# EAGLE design AthenaAmpli (EAGLE 7.2.0)
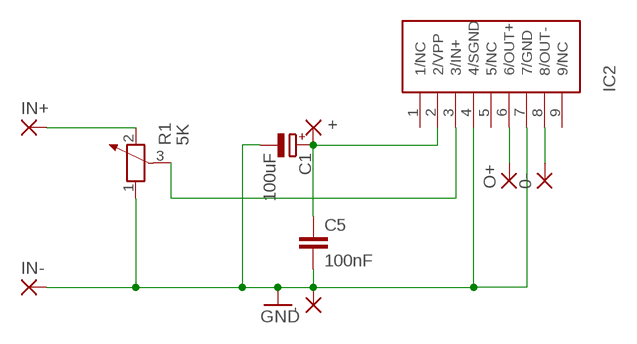
[diagram p0: schematic, sheet 1]

## Parts
0-  WIREPAD3,17/1,2  [3,17/1,2]
+  WIREPAD3,17/1,2  [3,17/1,2]
-  WIREPAD3,17/1,2  [3,17/1,2]
C1  100uF  CPOL-EUE3.5-8  [E3,5-8]
C5  100nF  C-EU050-024X044  [C050-024X044]
IC2  TDA7056  [SOT110-1]
IN+  WIREPAD3,17/1,2  [3,17/1,2]
IN-  WIREPAD3,17/1,2  [3,17/1,2]
O+  WIREPAD3,17/1,2  [3,17/1,2]
R1  5K  POTENTIOMETER_PT-10S  [PT-10S]

## Nets
GND: -.1(P) C1.- C5.2 IC2.4(4/SGND) IC2.7(7/GND) IN-.1(P) R1.1
N$1: +.1(P) C1.+ C5.1 IC2.2(2/VPP)
N$2: IC2.3(3/IN+) R1.3
N$3: IN+.1(P) R1.2
N$6: IC2.6(6/OUT+) O+.1(P)
N$8: 0-.1(P) IC2.8(8/OUT-)
Unconnected: IC2.1(1/NC) IC2.5(5/NC) IC2.9(9/NC)

## Library data of the parts
0- + - IN+ IN- O+ = wirepad:WIREPAD: Wire PAD connect wire on PCB
C1 = rcl:CPOL-EU: POLARIZED CAPACITOR, European symbol
C5 = rcl:C-EU: CAPACITOR, European symbol
IC2 = Audio-Power-amlifier V.2.0:TDA7056: The TDA7056 is a mono output amplifier, designed for battery-fed portable radios and mains-fed equipment such as television. For space reasons there is a trend to decrease the number of external components. For portable applications there is also a trend to decrease the number of battery cells, but still a reasonable output power is required. The TDA7056 fulfills both of these requirements. It needs no peripheral components, because it makes use of the Bridge-Tied-Load (BTL) principle. Consequently it has, at the same supply voltage, a higher output power compared to a conventional Single Ended output stage. It delivers an output power of 1 W into a loudspeaker load of 8 W with 6 V supply or 3 W into 16 W loudspeaker at 11 V without need of an external heatsink. The gain is internally fixed at 40 dB. Special attention is given to switch-on/off click suppression, and it has a good overall stability. The load can be short circuited at all input conditions.
R1 = rcl:POTENTIOMETER_: Potentiometer

## Board
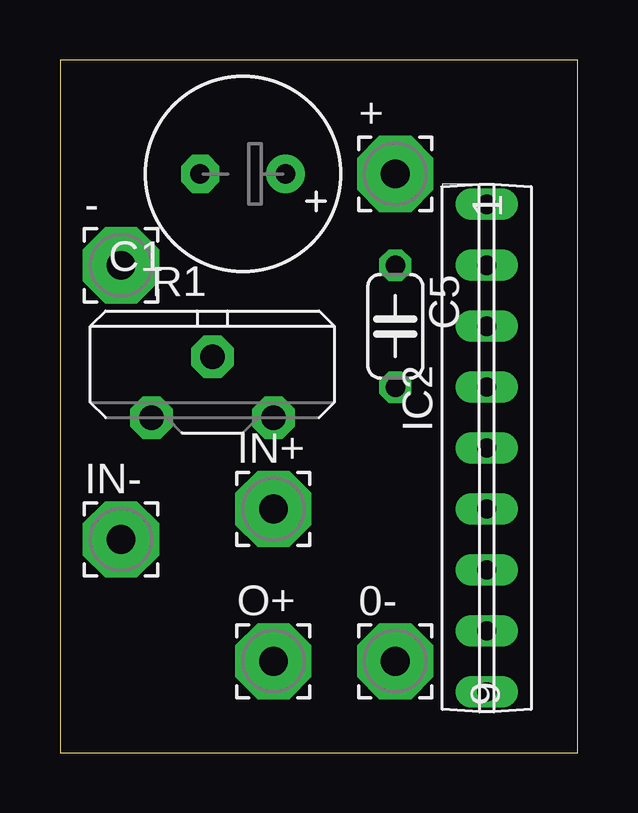
[diagram p1: board, top side]
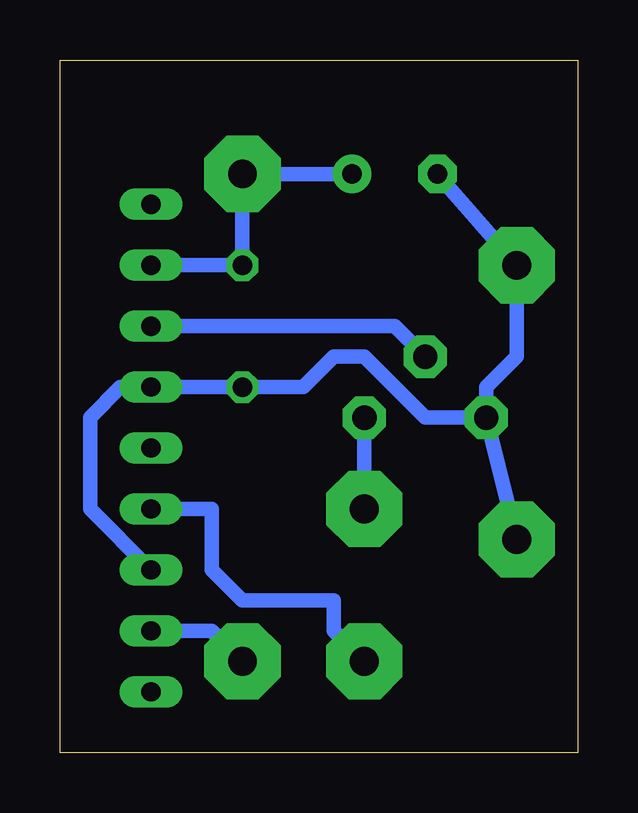
[diagram p2: board, bottom side, seen from below]

Size 21.57 x 28.88 mm. Coordinates in mm from the lower left corner, seen from the top.
Outline: 0,0 21.57,0 21.57,28.88 0,28.88 0,0
Copper layers (1*16): Top 0.035mm / dielectric 1.5mm / Bottom 0.035mm
Design rules "default": minimum track width 10mil, minimum drill 24mil, track to track 8mil, track to pad 8mil, pad to pad 8mil, via to via 8mil, smd to smd 8mil, copper to edge 40mil, drill to drill 8mil, minimum pad ring 10mil, minimum via ring 8mil, stop-mask expansion 4mil, vias tented up to drill 0mil, thermal gap 10mil

### Footprints (pad centres in the part's own frame; a part is rotated, then mirrored left to right if it is on the bottom)
3,17/1,2 = drill 1.194 pad 3.175 octagon: 1 0,0
E3,5-8 = drill 0.813 pad 1.6: + -1.778,0 | drill 0.813 pad 1.6 octagon: - 1.778,0
C050-024X044 = drill 0.813 octagon: 1 -2.54,0; 2 2.54,0
SOT110-1 = drill 0.8 long: 1 -10.16,0; 2 -7.62,0; 3 -5.08,0; 4 -2.54,0; 5 0,0; 6 2.54,0; 7 5.08,0; 8 7.62,0; 9 10.16,0
PT-10S = drill 1.016 pad 1.778 octagon: 1 -2.54,-1.27; 2 2.54,-1.27; 3 0,1.27

### Placement (x,y rotation side)
0-  13.97,3.81 0 top
+  13.97,24.13 0 top
-  2.54,20.32 0 top
C1  7.62,24.13 180 top
C5  13.97,17.78 270 top
IC2  17.78,12.7 270 top
IN+  8.89,10.16 0 top
IN-  2.54,8.89 0 top
O+  8.89,3.81 0 top
R1  6.35,15.24 0 top

### Tracks (layer width: path | path; a pad name or v marks a point on that pad's centre or on a via)
GND
  Bottom 0.61: C1.- -.1 2.54,16.51 3.81,15.24 R1.1 | IN-.1 R1.1 | IC2.7 20.32,10.16 20.32,13.97 19.05,15.24 IC2.4 C5.2 11.43,15.24 10.16,16.51 8.89,16.51 6.35,13.97 R1.1
N$1
  Bottom 0.61: C1.+ +.1 C5.1 IC2.2
N$2
  Bottom 0.61: R1.3 7.62,17.78 IC2.3
N$3
  Bottom 0.61: IN+.1 R1.2
N$6
  Bottom 0.61: O+.1 10.16,5.08 10.16,6.35 13.97,6.35 15.24,7.62 15.24,10.16 IC2.6
N$8
  Bottom 0.61: 0-.1 15.24,5.08 IC2.8